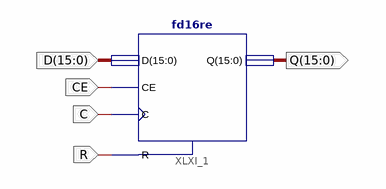
[diagram p0: schematic sheet 1]
// Xilinx ISE schematic register16.sch (spartan3e) as structural Verilog: 1 symbols, 5 ports
module register16 (
  input  [15:0] D,
  input  CE,
  input  C,
  input  R,
  output [15:0] Q
);

  fd16re XLXI_1 (.C(C), .CE(CE), .D(D), .R(R), .Q(Q));
endmodule
